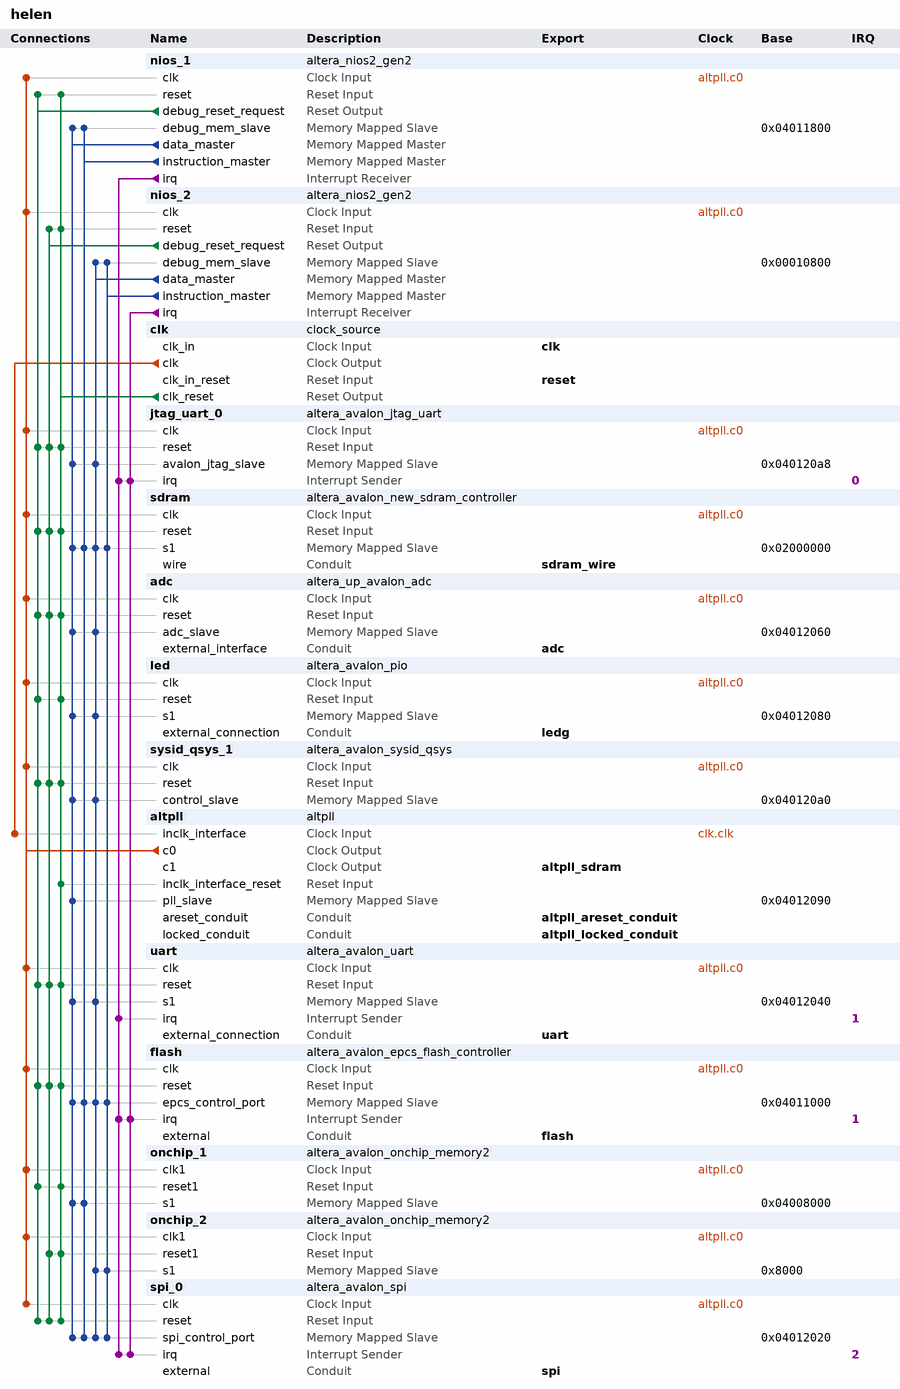
[diagram p0: system contents]
# Platform Designer (Qsys) system helen, Cyclone IV E EP4CE22F17C6
# Parameters at their usual value, and those the tool derives, are not listed.
package require -exact qsys 17.1
create_system helen
set_project_property DEVICE_FAMILY {Cyclone IV E}
set_project_property DEVICE EP4CE22F17C6

add_instance nios_1 altera_nios2_gen2 17.1
set_instance_parameter_value nios_1 dcache_size 2048
set_instance_parameter_value nios_1 exceptionOffset 256
set_instance_parameter_value nios_1 exceptionSlave onchip_1.s1
set_instance_parameter_value nios_1 icache_size 4096
set_instance_parameter_value nios_1 impl Tiny
set_instance_parameter_value nios_1 resetSlave onchip_1.s1

add_instance nios_2 altera_nios2_gen2 17.1
set_instance_parameter_value nios_2 dcache_size 2048
set_instance_parameter_value nios_2 exceptionOffset 256
set_instance_parameter_value nios_2 exceptionSlave onchip_2.s1
set_instance_parameter_value nios_2 icache_size 4096
set_instance_parameter_value nios_2 impl Tiny
set_instance_parameter_value nios_2 resetSlave onchip_2.s1

add_instance clk clock_source 17.1
set_instance_parameter_value clk clockFrequency 50000000

add_instance jtag_uart_0 altera_avalon_jtag_uart 17.1
set_instance_parameter_value jtag_uart_0 simInteractiveOptions NO_INTERACTIVE_WINDOWS

add_instance sdram altera_avalon_new_sdram_controller 17.1
set_instance_parameter_value sdram TAC 5.5
set_instance_parameter_value sdram TRCD 20.0
set_instance_parameter_value sdram TRP 20.0
set_instance_parameter_value sdram casLatency 3
set_instance_parameter_value sdram columnWidth 9
set_instance_parameter_value sdram dataWidth 16
set_instance_parameter_value sdram generateSimulationModel true
set_instance_parameter_value sdram model single_Micron_MT48LC4M32B2_7_chip
set_instance_parameter_value sdram numberOfBanks 4
set_instance_parameter_value sdram numberOfChipSelects 1
set_instance_parameter_value sdram powerUpDelay 100.0
set_instance_parameter_value sdram refreshPeriod 15.625
set_instance_parameter_value sdram rowWidth 13

add_instance adc altera_up_avalon_adc 17.1
set_instance_parameter_value adc board DE0-Nano
set_instance_parameter_value adc numch_ 8
set_instance_parameter_value adc sclk_freq 3.2

add_instance led altera_avalon_pio 17.1
set_instance_parameter_value led direction Output
set_instance_parameter_value led width 8

add_instance sysid_qsys_1 altera_avalon_sysid_qsys 17.1
set_instance_parameter_value sysid_qsys_1 id 0

add_instance altpll altpll 17.1
set_instance_parameter_value altpll CLK0_DIVIDE_BY 1
set_instance_parameter_value altpll CLK0_MULTIPLY_BY 2
set_instance_parameter_value altpll CLK1_DIVIDE_BY 1
set_instance_parameter_value altpll CLK1_DUTY_CYCLE 50
set_instance_parameter_value altpll CLK1_MULTIPLY_BY 2
set_instance_parameter_value altpll CLK1_PHASE_SHIFT -1667
set_instance_parameter_value altpll INCLK0_INPUT_FREQUENCY 20000
set_instance_parameter_value altpll PORT_ARESET PORT_USED
set_instance_parameter_value altpll PORT_LOCKED PORT_USED
set_instance_parameter_value altpll PORT_clk1 PORT_USED
set_instance_parameter_value altpll PORT_clk2 PORT_UNUSED
set_instance_parameter_value altpll PORT_clk3 PORT_UNUSED

add_instance uart altera_avalon_uart 17.1
set_instance_parameter_value uart baud 115200
set_instance_parameter_value uart dataBits 8
set_instance_parameter_value uart fixedBaud true
set_instance_parameter_value uart parity NONE
set_instance_parameter_value uart stopBits 1

add_instance flash altera_avalon_epcs_flash_controller 17.1
set_instance_parameter_value flash resetrequest_enabled true

add_instance onchip_1 altera_avalon_onchip_memory2 17.1
set_instance_parameter_value onchip_1 dataWidth 32
set_instance_parameter_value onchip_1 dualPort false
set_instance_parameter_value onchip_1 initMemContent true
set_instance_parameter_value onchip_1 initializationFileName onchip_mem.hex
set_instance_parameter_value onchip_1 memorySize 16384

add_instance onchip_2 altera_avalon_onchip_memory2 17.1
set_instance_parameter_value onchip_2 dataWidth 32
set_instance_parameter_value onchip_2 dualPort false
set_instance_parameter_value onchip_2 initMemContent true
set_instance_parameter_value onchip_2 initializationFileName onchip_mem.hex
set_instance_parameter_value onchip_2 memorySize 16384

add_instance spi_0 altera_avalon_spi 17.1
set_instance_parameter_value spi_0 clockPolarity 0
set_instance_parameter_value spi_0 dataWidth 24
set_instance_parameter_value spi_0 masterSPI true
set_instance_parameter_value spi_0 numberOfSlaves 1
set_instance_parameter_value spi_0 targetClockRate 20000000

# connections
add_connection altpll.c0 adc.clk clock
add_connection altpll.c0 flash.clk clock
add_connection altpll.c0 jtag_uart_0.clk clock
add_connection altpll.c0 led.clk clock
add_connection altpll.c0 nios_1.clk clock
add_connection altpll.c0 nios_2.clk clock
add_connection altpll.c0 onchip_1.clk1 clock
add_connection altpll.c0 onchip_2.clk1 clock
add_connection altpll.c0 sdram.clk clock
add_connection altpll.c0 spi_0.clk clock
add_connection altpll.c0 sysid_qsys_1.clk clock
add_connection altpll.c0 uart.clk clock
add_connection clk.clk altpll.inclk_interface clock
add_connection clk.clk_reset adc.reset reset
add_connection clk.clk_reset altpll.inclk_interface_reset reset
add_connection clk.clk_reset flash.reset reset
add_connection clk.clk_reset jtag_uart_0.reset reset
add_connection clk.clk_reset led.reset reset
add_connection clk.clk_reset nios_1.reset reset
add_connection clk.clk_reset nios_2.reset reset
add_connection clk.clk_reset onchip_1.reset1 reset
add_connection clk.clk_reset onchip_2.reset1 reset
add_connection clk.clk_reset sdram.reset reset
add_connection clk.clk_reset spi_0.reset reset
add_connection clk.clk_reset sysid_qsys_1.reset reset
add_connection clk.clk_reset uart.reset reset
add_connection nios_1.debug_reset_request adc.reset reset
add_connection nios_1.debug_reset_request flash.reset reset
add_connection nios_1.debug_reset_request jtag_uart_0.reset reset
add_connection nios_1.debug_reset_request led.reset reset
add_connection nios_1.debug_reset_request nios_1.reset reset
add_connection nios_1.debug_reset_request onchip_1.reset1 reset
add_connection nios_1.debug_reset_request sdram.reset reset
add_connection nios_1.debug_reset_request spi_0.reset reset
add_connection nios_1.debug_reset_request sysid_qsys_1.reset reset
add_connection nios_1.debug_reset_request uart.reset reset
add_connection nios_2.debug_reset_request adc.reset reset
add_connection nios_2.debug_reset_request flash.reset reset
add_connection nios_2.debug_reset_request jtag_uart_0.reset reset
add_connection nios_2.debug_reset_request nios_2.reset reset
add_connection nios_2.debug_reset_request onchip_2.reset1 reset
add_connection nios_2.debug_reset_request sdram.reset reset
add_connection nios_2.debug_reset_request spi_0.reset reset
add_connection nios_2.debug_reset_request sysid_qsys_1.reset reset
add_connection nios_2.debug_reset_request uart.reset reset
add_connection nios_1.data_master adc.adc_slave avalon
set_connection_parameter_value nios_1.data_master/adc.adc_slave baseAddress 0x04012060
add_connection nios_1.data_master altpll.pll_slave avalon
set_connection_parameter_value nios_1.data_master/altpll.pll_slave baseAddress 0x04012090
add_connection nios_1.data_master flash.epcs_control_port avalon
set_connection_parameter_value nios_1.data_master/flash.epcs_control_port baseAddress 0x04011000
add_connection nios_1.data_master jtag_uart_0.avalon_jtag_slave avalon
set_connection_parameter_value nios_1.data_master/jtag_uart_0.avalon_jtag_slave baseAddress 0x040120a8
add_connection nios_1.data_master led.s1 avalon
set_connection_parameter_value nios_1.data_master/led.s1 baseAddress 0x04012080
add_connection nios_1.data_master nios_1.debug_mem_slave avalon
set_connection_parameter_value nios_1.data_master/nios_1.debug_mem_slave baseAddress 0x04011800
add_connection nios_1.data_master onchip_1.s1 avalon
set_connection_parameter_value nios_1.data_master/onchip_1.s1 baseAddress 0x04008000
add_connection nios_1.data_master sdram.s1 avalon
set_connection_parameter_value nios_1.data_master/sdram.s1 baseAddress 0x02000000
add_connection nios_1.data_master spi_0.spi_control_port avalon
set_connection_parameter_value nios_1.data_master/spi_0.spi_control_port baseAddress 0x04012020
add_connection nios_1.data_master sysid_qsys_1.control_slave avalon
set_connection_parameter_value nios_1.data_master/sysid_qsys_1.control_slave baseAddress 0x040120a0
add_connection nios_1.data_master uart.s1 avalon
set_connection_parameter_value nios_1.data_master/uart.s1 baseAddress 0x04012040
add_connection nios_1.instruction_master flash.epcs_control_port avalon
set_connection_parameter_value nios_1.instruction_master/flash.epcs_control_port baseAddress 0x04011000
add_connection nios_1.instruction_master nios_1.debug_mem_slave avalon
set_connection_parameter_value nios_1.instruction_master/nios_1.debug_mem_slave baseAddress 0x04011800
add_connection nios_1.instruction_master onchip_1.s1 avalon
set_connection_parameter_value nios_1.instruction_master/onchip_1.s1 baseAddress 0x04008000
add_connection nios_1.instruction_master sdram.s1 avalon
set_connection_parameter_value nios_1.instruction_master/sdram.s1 baseAddress 0x02000000
add_connection nios_1.instruction_master spi_0.spi_control_port avalon
set_connection_parameter_value nios_1.instruction_master/spi_0.spi_control_port baseAddress 0x04012020
add_connection nios_2.data_master adc.adc_slave avalon
set_connection_parameter_value nios_2.data_master/adc.adc_slave baseAddress 0x04012060
add_connection nios_2.data_master flash.epcs_control_port avalon
set_connection_parameter_value nios_2.data_master/flash.epcs_control_port baseAddress 0x04011000
add_connection nios_2.data_master jtag_uart_0.avalon_jtag_slave avalon
set_connection_parameter_value nios_2.data_master/jtag_uart_0.avalon_jtag_slave baseAddress 0x040120a8
add_connection nios_2.data_master led.s1 avalon
set_connection_parameter_value nios_2.data_master/led.s1 baseAddress 0x04012080
add_connection nios_2.data_master nios_2.debug_mem_slave avalon
set_connection_parameter_value nios_2.data_master/nios_2.debug_mem_slave baseAddress 0x00010800
add_connection nios_2.data_master onchip_2.s1 avalon
set_connection_parameter_value nios_2.data_master/onchip_2.s1 baseAddress 0x8000
add_connection nios_2.data_master sdram.s1 avalon
set_connection_parameter_value nios_2.data_master/sdram.s1 baseAddress 0x02000000
add_connection nios_2.data_master spi_0.spi_control_port avalon
set_connection_parameter_value nios_2.data_master/spi_0.spi_control_port baseAddress 0x04012020
add_connection nios_2.data_master sysid_qsys_1.control_slave avalon
set_connection_parameter_value nios_2.data_master/sysid_qsys_1.control_slave baseAddress 0x040120a0
add_connection nios_2.data_master uart.s1 avalon
set_connection_parameter_value nios_2.data_master/uart.s1 baseAddress 0x04012040
add_connection nios_2.instruction_master flash.epcs_control_port avalon
set_connection_parameter_value nios_2.instruction_master/flash.epcs_control_port baseAddress 0x04011000
add_connection nios_2.instruction_master nios_2.debug_mem_slave avalon
set_connection_parameter_value nios_2.instruction_master/nios_2.debug_mem_slave baseAddress 0x00010800
add_connection nios_2.instruction_master onchip_2.s1 avalon
set_connection_parameter_value nios_2.instruction_master/onchip_2.s1 baseAddress 0x8000
add_connection nios_2.instruction_master sdram.s1 avalon
set_connection_parameter_value nios_2.instruction_master/sdram.s1 baseAddress 0x02000000
add_connection nios_2.instruction_master spi_0.spi_control_port avalon
set_connection_parameter_value nios_2.instruction_master/spi_0.spi_control_port baseAddress 0x04012020
add_connection nios_1.irq flash.irq interrupt
set_connection_parameter_value nios_1.irq/flash.irq irqNumber 2
add_connection nios_1.irq jtag_uart_0.irq interrupt
set_connection_parameter_value nios_1.irq/jtag_uart_0.irq irqNumber 0
add_connection nios_1.irq spi_0.irq interrupt
set_connection_parameter_value nios_1.irq/spi_0.irq irqNumber 3
add_connection nios_1.irq uart.irq interrupt
set_connection_parameter_value nios_1.irq/uart.irq irqNumber 1
add_connection nios_2.irq flash.irq interrupt
set_connection_parameter_value nios_2.irq/flash.irq irqNumber 1
add_connection nios_2.irq jtag_uart_0.irq interrupt
set_connection_parameter_value nios_2.irq/jtag_uart_0.irq irqNumber 0
add_connection nios_2.irq spi_0.irq interrupt
set_connection_parameter_value nios_2.irq/spi_0.irq irqNumber 2

# exported interfaces
add_interface adc conduit end
set_interface_property adc EXPORT_OF adc.external_interface
add_interface altpll_areset_conduit conduit end
set_interface_property altpll_areset_conduit EXPORT_OF altpll.areset_conduit
add_interface altpll_locked_conduit conduit end
set_interface_property altpll_locked_conduit EXPORT_OF altpll.locked_conduit
add_interface altpll_sdram clock source
set_interface_property altpll_sdram EXPORT_OF altpll.c1
add_interface clk clock sink
set_interface_property clk EXPORT_OF clk.clk_in
add_interface flash conduit end
set_interface_property flash EXPORT_OF flash.external
add_interface ledg conduit end
set_interface_property ledg EXPORT_OF led.external_connection
add_interface reset reset sink
set_interface_property reset EXPORT_OF clk.clk_in_reset
add_interface sdram_wire conduit end
set_interface_property sdram_wire EXPORT_OF sdram.wire
add_interface spi conduit end
set_interface_property spi EXPORT_OF spi_0.external
add_interface uart conduit end
set_interface_property uart EXPORT_OF uart.external_connection

set_interconnect_requirement {$system} qsys_mm.clockCrossingAdapter HANDSHAKE
set_interconnect_requirement {$system} qsys_mm.enableEccProtection FALSE
set_interconnect_requirement {$system} qsys_mm.insertDefaultSlave FALSE
set_interconnect_requirement {$system} qsys_mm.maxAdditionalLatency 1

save_system helen.qsys
